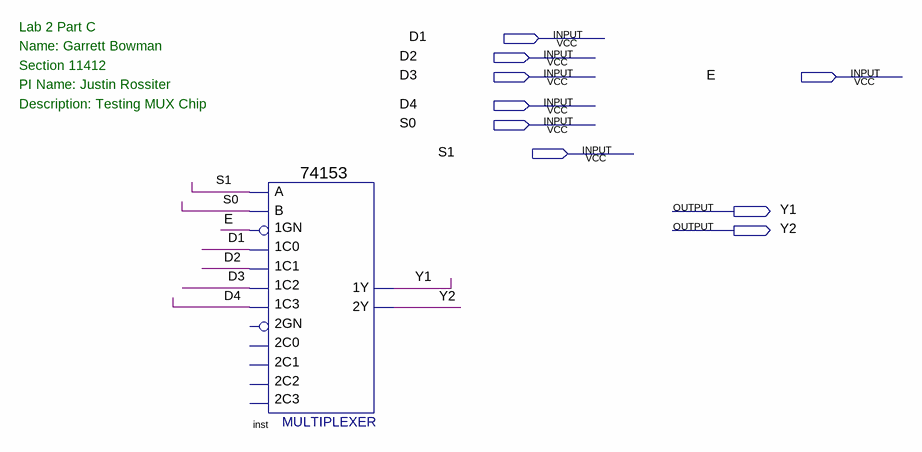
[diagram p0: schematic sheet]
// Quartus schematic Lab2_MUX_TEST.bdf as structural Verilog: 1 symbols, 9 pins
module Lab2_MUX_TEST (
  input  D1,
  input  D2,
  input  D3,
  input  E,
  input  D4,
  input  S0,
  input  S1,
  output Y1,
  output Y2
);

  \74153  inst (
    .\1C1 (D2), .\1GN (E), .\1C0 (D1), .\1C2 (D3), .\1C3 (D4), .B(S0), .A(S1), .\1Y (Y1), .\2Y (Y2));  // open: 2C0, 2GN, 2C2, 2C1, 2C3

  // Notes on the sheet:
  //   Lab 2 Part C
  //   Name: Garrett Bowman
  //   Section 11412
  //   PI Name: Justin Rossiter
  //   Description: Testing MUX Chip
endmodule
